# EasyEDA Pro project ProProject_FPC_SHT4x_LPS22_2024-05-12.epro

# Schematic Schematic1
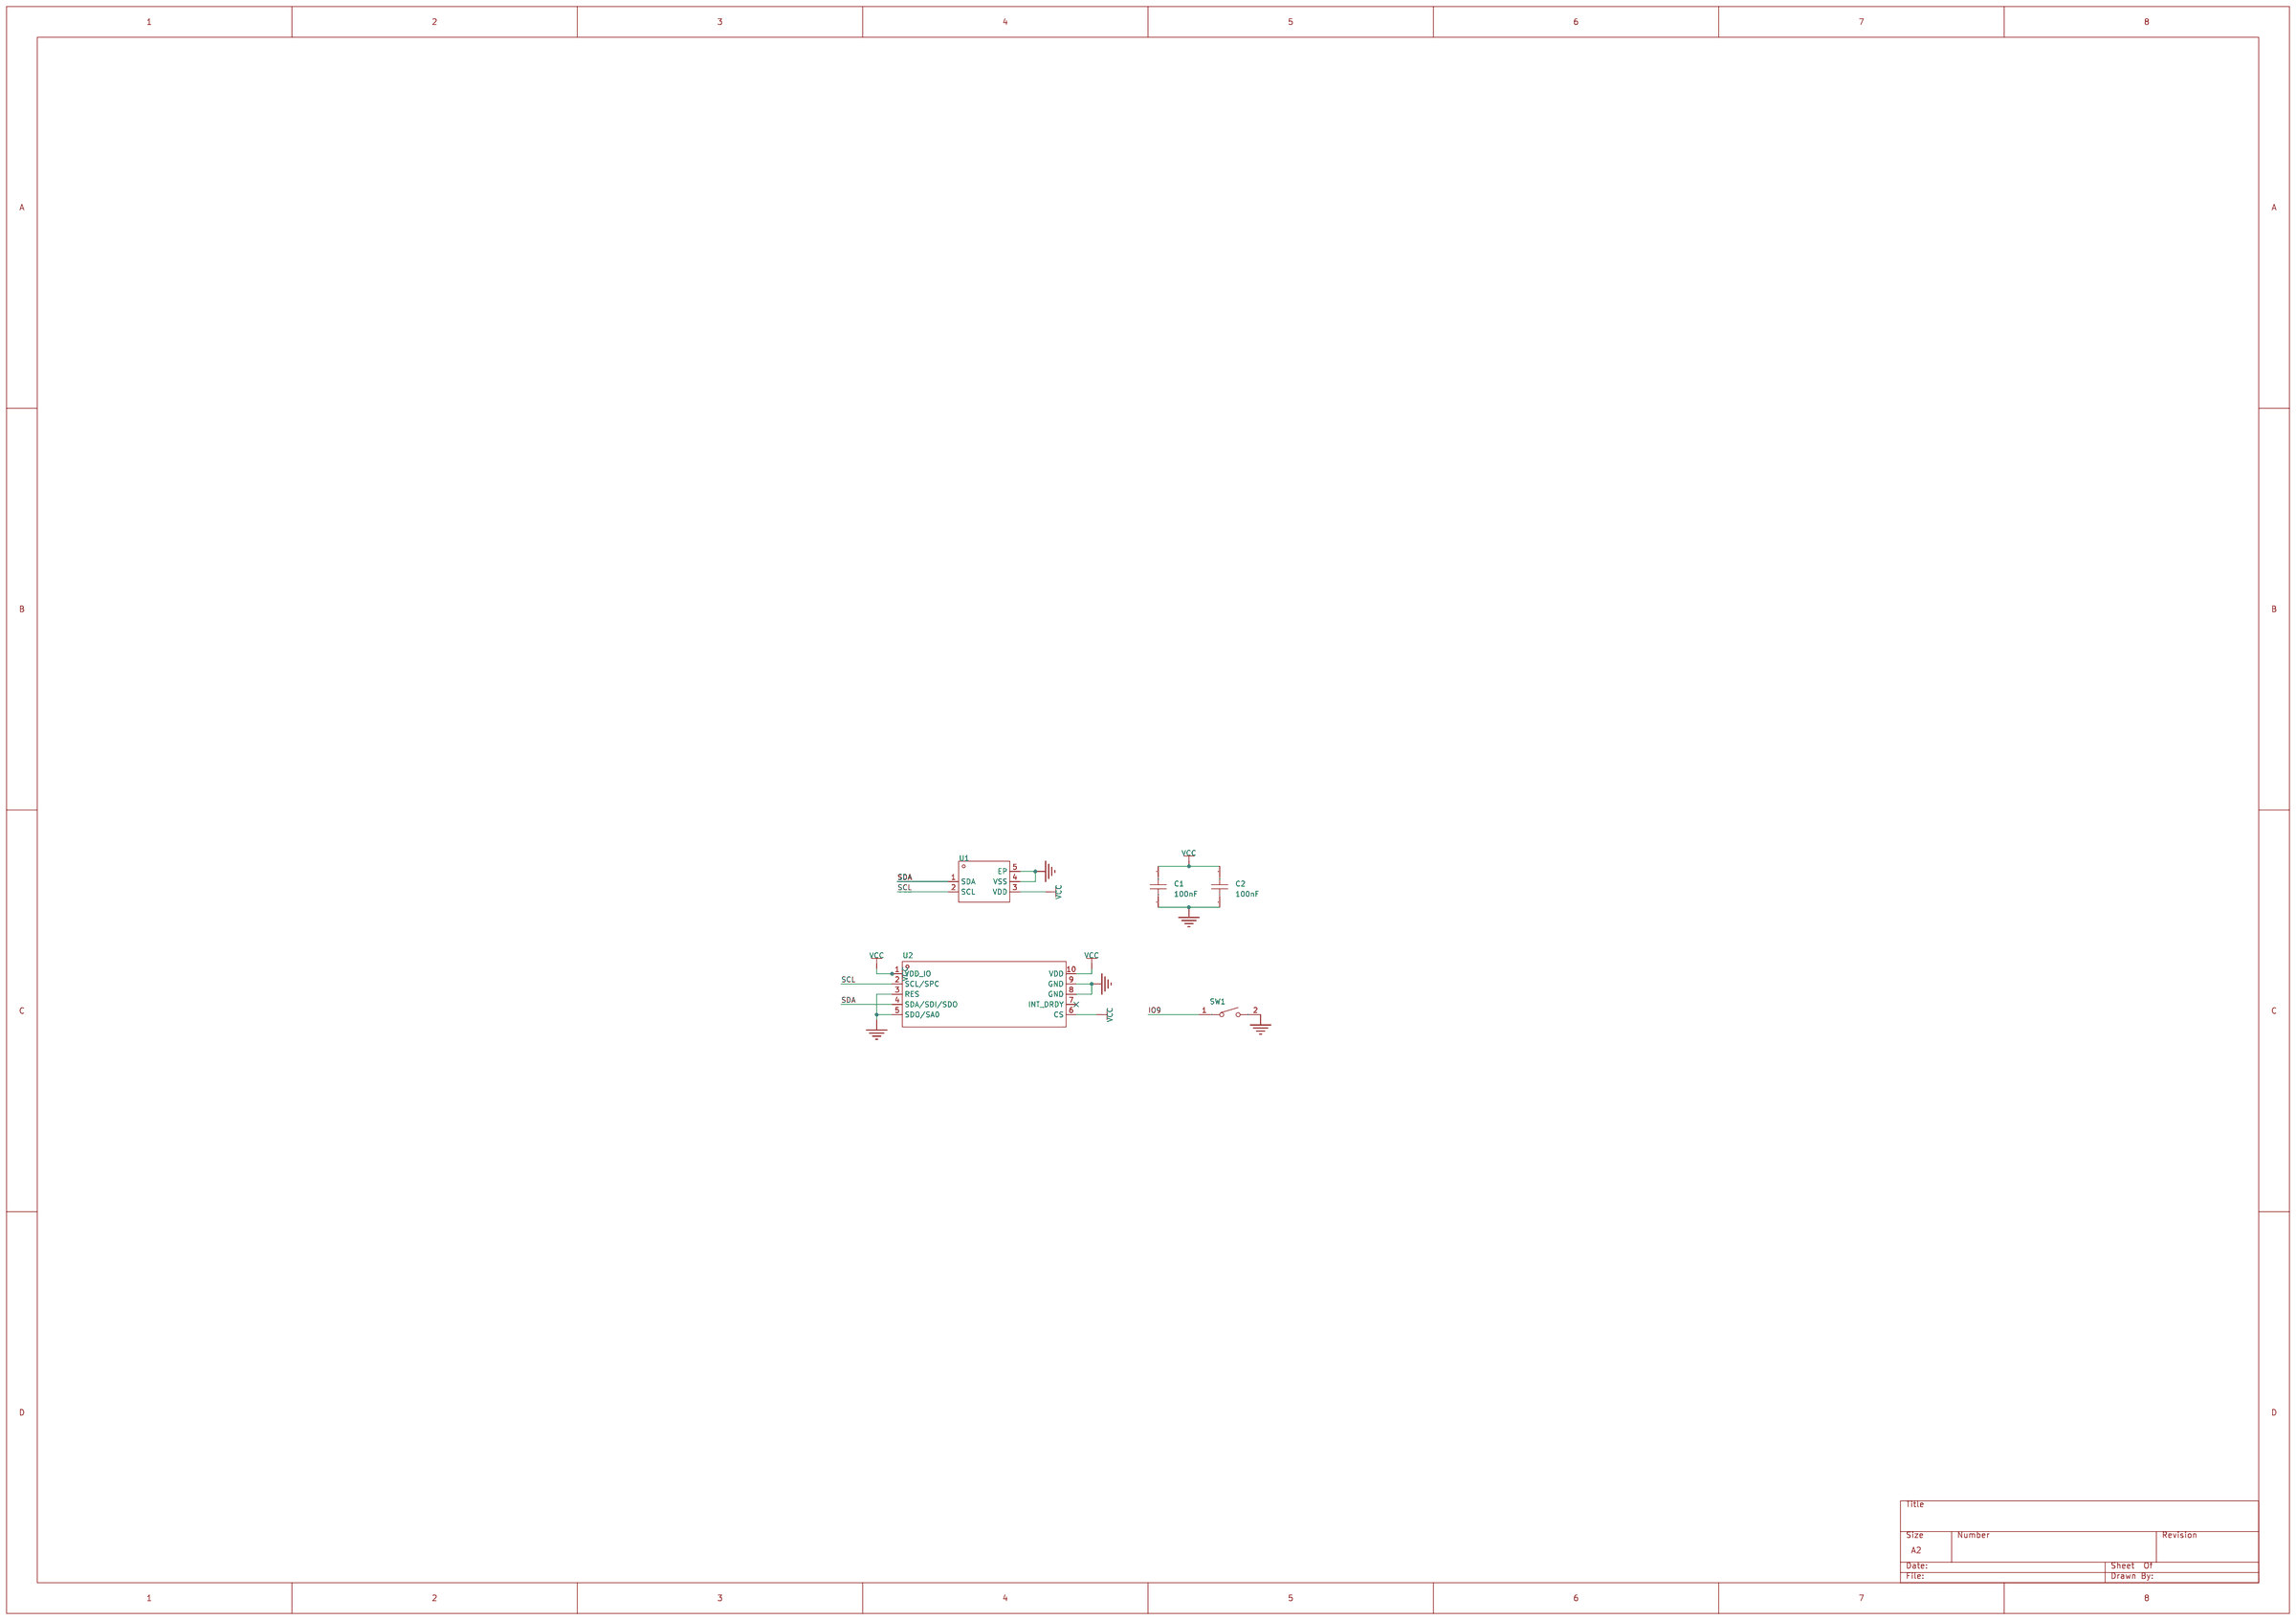
[diagram p0: schematic sheet]

## Parts
C1  100nF  [C0402]
C2  100nF  [C0402]
SW1  TS-1088-AR02016  [SW-SMD_L3.9-W3.0-P4.45]
U1  SHT40-AD1B-R2  [DFN-4_L1.5-W1.5-P0.8-TL-EP]
U2  LPS22HBTR  [HLGA-10L_LPS22HBTR]

## Library data of the parts
C1 C2 = CAP_0402: Supplier Footprint: 0402
SW1 = TS-1088-AR02016: 电路结构:单刀单掷;按钮形状:圆形按钮;作用力:160gf;安装方式:立贴;开关长度:4mm;开关宽度:3mm;开关高度:2mm;带支架:不带;触点电流:50mA;额定电压(DC):12V;绝缘电阻:100MΩ;机械寿命:10万次;; LCSC Part Name: 4*3*2mm 立贴 轻触开关; Supplier Part: C720477; Manufacturer: XUNPU(讯普); Supplier Footprint: SMD; JLCPCB Part Class: 扩展库; Datasheet: https://atta.szlcsc.com/upload/public/pdf/source/20200810/C720475_60D09DD6C54279ADDB2DC25100F1CC11.pdf; Supplier: LCSC; Circuit: 单刀单掷; Actuator Style: 圆形按钮; Operating Force: 160gf; Mounting Style: 立贴; Switch Length: 4mm; Switch Width: 3mm; Switch Height: 2mm; Strike Gundam: 不带; Contact Current: 50mA; Voltage Rating (DC): 12V; Insulation Resistance: 100MΩ; Actuator/Cap Color: 黑色; Pin Style: SMD接片; Mechanical Life: 10万次; Operating Temperature: -30℃~+80℃
U1 = SHT40-AD1B-R2: ±1.8% / max. ±3.5% RH 数字温湿度传感器; Supplier Part: C2909890; Manufacturer: Sensirion(瑞士盛思锐); Supplier Footprint: DFN-4-EP(1.5x1.5); Datasheet: https://atta.szlcsc.com/upload/public/pdf/source/20211021/851BA36A5CA574D725310F52CADA4510.pdf; Supplier: LCSC
U2 = LPS22HBTR: 压力范围:26Kpa~126Kpa;; Supplier Part: C94049; Manufacturer: ST(意法半导体); Supplier Footprint: HLGA-10(2x2); Datasheet: https://atta.szlcsc.com/upload/public/pdf/source/20170908/C94049_1504870171328958154.pdf; Supplier: LCSC; Pressure range: 26Kpa~126Kpa; The Power Supply Voltage: 1.7V~3.6V; Operating Temperature: -40℃~+85℃

## Nets
GND: C1.1 C2.1 SW1.2 U1.4(VSS) U1.5(EP) U2.3(RES) U2.5(SDO/SA0) U2.8(GND) U2.9(GND)
VCC: C1.2 C2.2 U1.3(VDD) U2.1(VDD_IO) U2.6(CS) U2.10(VDD)
IO9: SW1.1
SCL: U1.2(SCL) U2.2(SCL/SPC)
SDA: U1.1(SDA) U2.4(SDA/SDI/SDO)

Not connected (* = marked no-connect by the designer): U2 7(INT_DRDY)*

# Board PCB1
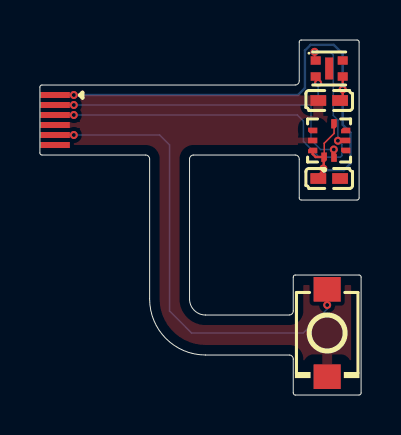
[diagram p1: board, top side]
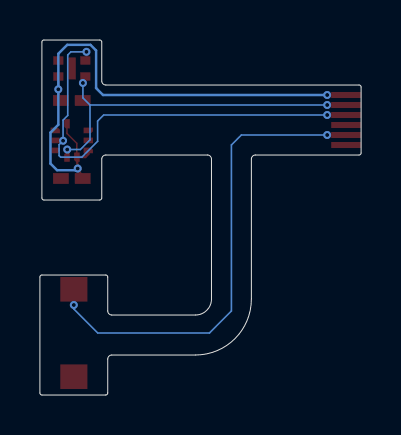
[diagram p2: board, bottom side, seen from below]

Outline 16.1 x 17.75 mm; copper layers: Top Layer, Bottom Layer. Coordinates in mm from the lower left corner of the outline.
Outline path: 0,15.4 0,12.1 arc(0.03,12.03) 0.1,12 5.3,12 arc(5.44,11.94) 5.5,11.8 5.5,4.8 arc(6.32,2.82) 8.3,2 12.5,2 arc(12.64,1.94) 12.7,1.8 12.7,0.1 arc(12.73,0.03) 12.8,0 16,0 arc(16.07,0.03) 16.1,0.1 16.1,5.9 arc(16.07,5.97) 16,6 12.8,6 arc(12.73,5.97) 12.7,5.9 12.7,4.2 arc(12.64,4.06) 12.5,4 8.3,4 arc(7.73,4.23) 7.5,4.8 7.5,11.8 arc(7.56,11.94) 7.7,12 12.8,12 arc(12.94,11.94) 13,11.8 13,9.85 arc(13.03,9.78) 13.1,9.75 15.9,9.75 arc(15.97,9.78) 16,9.85 16,17.65 arc(15.97,17.72) 15.9,17.75 13.1,17.75 arc(13.03,17.72) 13,17.65 13,15.7 arc(12.94,15.56) 12.8,15.5 0.1,15.5 arc(0.03,15.47) 0,15.4
Stack: Top Layer 0.012mm / Dielectric1 0.025mm FR4 er 4.5 / Bottom Layer 0.012mm

## Design rules (mm)
template: 自定义配置
spacing copperThickness1oz (default): track to track 0.076, other pairs 0.076 to 0.152
spacing copperThickness2oz: track to track 0.203, other pairs 0.152 to 0.3
track width copperThickness1oz (default): min 0.076, default 0.076, max 2.54
track width copperThickness2oz: min 0.203, default 0.254, max 2.54
differential pair differentialPair (default): width min 0.127, default 0.254, max 2.54; gap min 0.152, default 0.152
via viaSize (default): diameter min 0.399, default 0.399, max 10; hole min 0.201, default 0.201, max 6.299

## Placement (name value [footprint] x y rotation side)
C1  100nF  [C0402]  14.5 14.73 0 top
C2  100nF  [C0402]  14.5 10.83 180 top
NOREF  -  [Pad_e11]  0.75 14.5 90 top
NOREF#2  -  [Pad_e8]  0.75 15 90 top
NOREF#3  -  [Pad_e6]  0.75 13 90 top
NOREF#4  -  [Pad_e17]  0.75 12.5 90 top
NOREF#5  -  [Pad_e13]  0.75 13.5 90 top
NOREF#6  -  [Pad_e12]  0.75 14 90 top
SW1  TS-1088-AR02016  [SW-SMD_L3.9-W3.0-P4.45]  14.4 3.1 270 top
U1  SHT40-AD1B-R2  [DFN-4_L1.5-W1.5-P0.8-TL-EP]  14.5 16.33 0 top
U2  LPS22HBTR  [HLGA-10L_LPS22HBTR]  14.5 12.73 90 top

## Footprints (pads in the part's own frame, mm; a bottom-side part is the same pattern mirrored in y, then rotated)
C0402
  rect 0.79x0.54 smd: 1(-0.545,0) 2(0.545,0)
DFN-4_L1.5-W1.5-P0.8-TL-EP
  rect 0.505x0.42 smd: 1(-0.677,0.4) 2(-0.677,-0.4) 3(0.677,-0.4) 4(0.677,0.4)
  rect 0.4x1.1 smd: 5(0,0)
HLGA-10L_LPS22HBTR
  custom 0.465x0.28 smd: 1(-0.832,0.255) 2(-0.835,-0.241) 6(0.835,-0.241)
  custom 0.28x0.465 smd: 3(-0.5,-0.827) 5(0.5,-0.827) 8(0.5,0.827) 10(-0.5,0.827)
  rect 0.28x0.465 smd: 4(0,-0.828) 9(0,0.828)
Pad_e6
  rect 0.3x1.5 smd: 11(0,0)
Pad_e8
  rect 0.3x1.5 smd: 11(0,0)
Pad_e11
  rect 0.3x1.5 smd: 11(0,0)
Pad_e12
  rect 0.3x1.5 smd: 11(0,0)
Pad_e13
  rect 0.3x1.5 smd: 11(0,0)
Pad_e17
  rect 0.3x1.5 smd: 11(0,0)
SW-SMD_L3.9-W3.0-P4.45
  rect 1.23x1.36 smd: 1(-2.185,0) 2(2.185,0)

## Nets
GND: C1.1 C2.1 NOREF#5.11 SW1.2 U1.4 U1.5 U2.3 U2.5 U2.8 U2.9
VCC: C1.2 C2.2 NOREF#2.11 U1.3 U2.1 U2.6 U2.10
IO9: NOREF#3.11 SW1.1
SCL: NOREF.11 U1.2 U2.2
SDA: NOREF#6.11 U1.1 U2.4

Pads without a net: NOREF#4 11

## Via types
v1: diameter 0.4, hole 0.2, Top Layer to Bottom Layer, 6 vias
v2: diameter 0.399, hole 0.201, Top Layer to Bottom Layer, 5 vias

## Routing (per net, layer and track width the routed paths; a pad name or vN(x,y) marks a point on that pad's centre or on a via; arc(x,y) is an arc through that point)
VCC: length 29.1
  Top Layer w0.076: NOREF#2.11 v2(1.7,15) ; 14.25,11.89 14.25,11.9 14.25,12.59 14.75,13.08 14.75,13.56
  Top Layer w0.12: C1.2 15.18,14.86 v1(15.18,15.28) U1.3 ; C2.2 13.96,10.97 14.23,11.24 14.23,11.88 14.25,11.89 14.24,11.9 13.82,11.9 13.67,12.05 U2.10
  Bottom Layer w0.12: v2(1.7,15) 12.94,15 13.28,15.35 13.28,17.23 13.56,17.51 14.73,17.51 15.18,17.06 v1(15.18,15.28) 15.18,13.51 15.57,13.12 15.57,11.57 15.24,11.24 14.29,11.24 v1(14.21,11.32)
IO9: length 24.1
  Top Layer w0.076: v2(1.7,13) NOREF#3.11 ; SW1.1 v2(14.4,4.5)
  Bottom Layer w0.076: v2(14.4,4.5) 14.4,4.3 13.2,3.1 7.6,3.1 6.5,4.2 6.5,12.5 6,13 v2(1.7,13)
SCL: length 17.9
  Top Layer w0.076: U1.2 13.94,15.8 v1(13.94,15.6) ; NOREF.11 v2(1.7,14.5) ; v1(14.73,12.27) 14.73,11.91 14.75,11.89
  Bottom Layer w0.076: 13.59,14.5 13.59,12.76 14.07,12.27 v1(14.73,12.27) ; 13.59,14.5 13.94,14.86 v1(13.94,15.6) ; 13.59,14.5 v2(1.7,14.5)
SDA: length 23
  Top Layer w0.076: v1(13.77,17.16) 13.77,16.78 13.82,16.73 ; NOREF#6.11 v2(1.7,14) ; U2.4 15.32,12.71 v1(14.94,12.71)
  Bottom Layer w0.076: 14.9,12.73 14.91,12.71 v1(14.94,12.71) ; v1(14.94,12.71) 15.14,12.51 15.14,11.97 15.06,11.89 14,11.89 13.21,12.68 13.21,13.7 12.9,14 v2(1.7,14) ; v1(14.94,12.71) 14.94,13.74 14.71,13.98 14.71,17 14.55,17.16 v1(13.77,17.16)

## Copper pours and planes (outline as drawn; the poured copper is in the pictures)
GND on Top Layer: -2.77,20.29 19.71,20.29 19.71,-3.22 -2.77,-3.22
